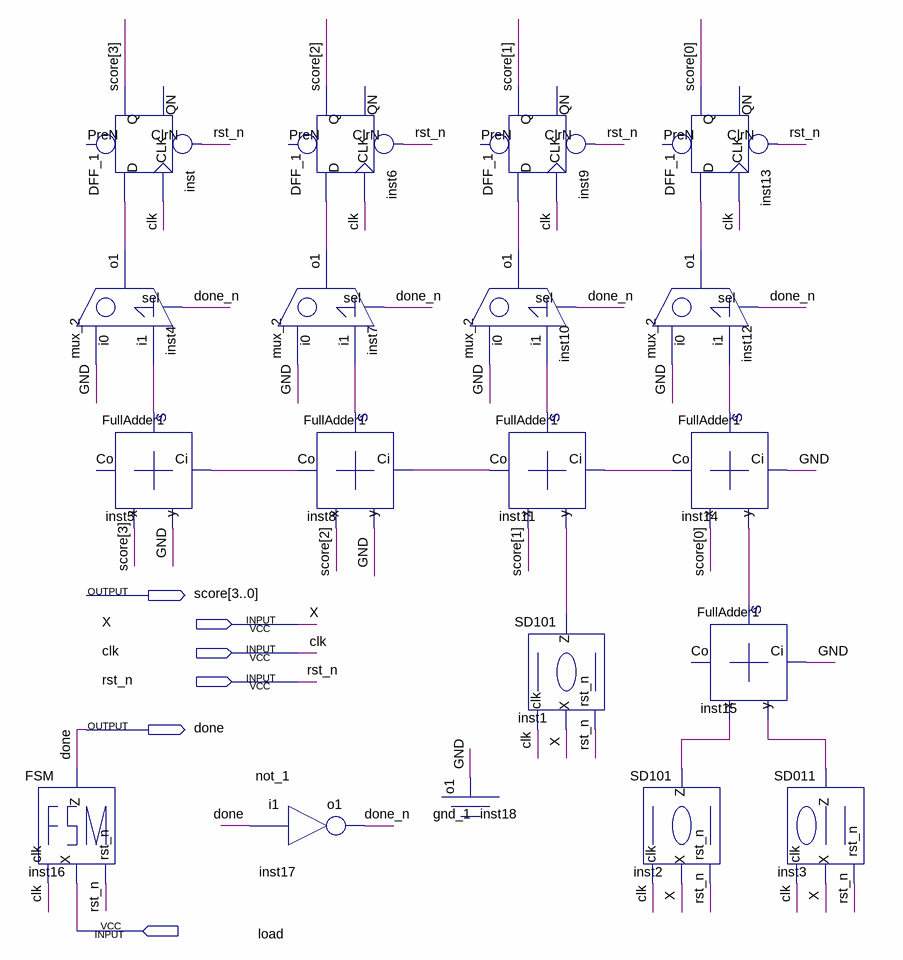
[diagram p0: schematic sheet]
// Quartus schematic WSC.bdf as structural Verilog: 19 symbols, 6 pins
module WSC (
  input  X,
  input  clk,
  input  rst_n,
  input  load,
  output [3:0] score,
  output done
);

  wire done_n, GND, inst1_z, inst2_z, inst3_z, inst4_o1, inst5_s, inst7_o1, inst8_co, inst8_s, inst10_o1,
       inst11_co, inst11_s, inst12_o1, inst14_co, inst14_s, inst15_s;

  mux_2 inst4 (.sel(done_n), .i0(GND), .i1(inst5_s), .o1(inst4_o1));
  FSM inst16 (.X(load), .clk(clk), .rst_n(rst_n), .Z(done));
  DFF_1 inst (.CLK(clk), .D(inst4_o1), .ClrN(rst_n), .Q(score[3]));  // open: PreN, QN
  FullAdder1 inst5 (.y(GND), .Ci(inst8_co), .x(score[3]), .S(inst5_s));  // open: Co
  DFF_1 inst6 (.CLK(clk), .D(inst7_o1), .ClrN(rst_n), .Q(score[2]));  // open: PreN, QN
  mux_2 inst7 (.sel(done_n), .i0(GND), .i1(inst8_s), .o1(inst7_o1));
  FullAdder1 inst8 (.y(GND), .Ci(inst11_co), .x(score[2]), .S(inst8_s), .Co(inst8_co));
  not_1 inst17 (.i1(done), .o1(done_n));
  mux_2 inst10 (.sel(done_n), .i0(GND), .i1(inst11_s), .o1(inst10_o1));
  gnd_1 inst18 (.o1(GND));
  DFF_1 inst9 (.CLK(clk), .D(inst10_o1), .ClrN(rst_n), .Q(score[1]));  // open: PreN, QN
  FullAdder1 inst11 (.y(inst1_z), .Ci(inst14_co), .x(score[1]), .S(inst11_s), .Co(inst11_co));
  SD101 inst1 (.X(X), .clk(clk), .rst_n(rst_n), .Z(inst1_z));
  DFF_1 inst13 (.CLK(clk), .D(inst12_o1), .ClrN(rst_n), .Q(score[0]));  // open: PreN, QN
  mux_2 inst12 (.sel(done_n), .i0(GND), .i1(inst14_s), .o1(inst12_o1));
  FullAdder1 inst14 (.y(inst15_s), .Ci(GND), .x(score[0]), .S(inst14_s), .Co(inst14_co));
  FullAdder1 inst15 (.y(inst3_z), .Ci(GND), .x(inst2_z), .S(inst15_s));  // open: Co
  SD101 inst2 (.X(X), .clk(clk), .rst_n(rst_n), .Z(inst2_z));
  SD011 inst3 (.X(X), .rst_n(rst_n), .clk(clk), .Z(inst3_z));
endmodule
